# Altium schematic sheet P05 CPLD.SchDoc
size 297 x 209 mm
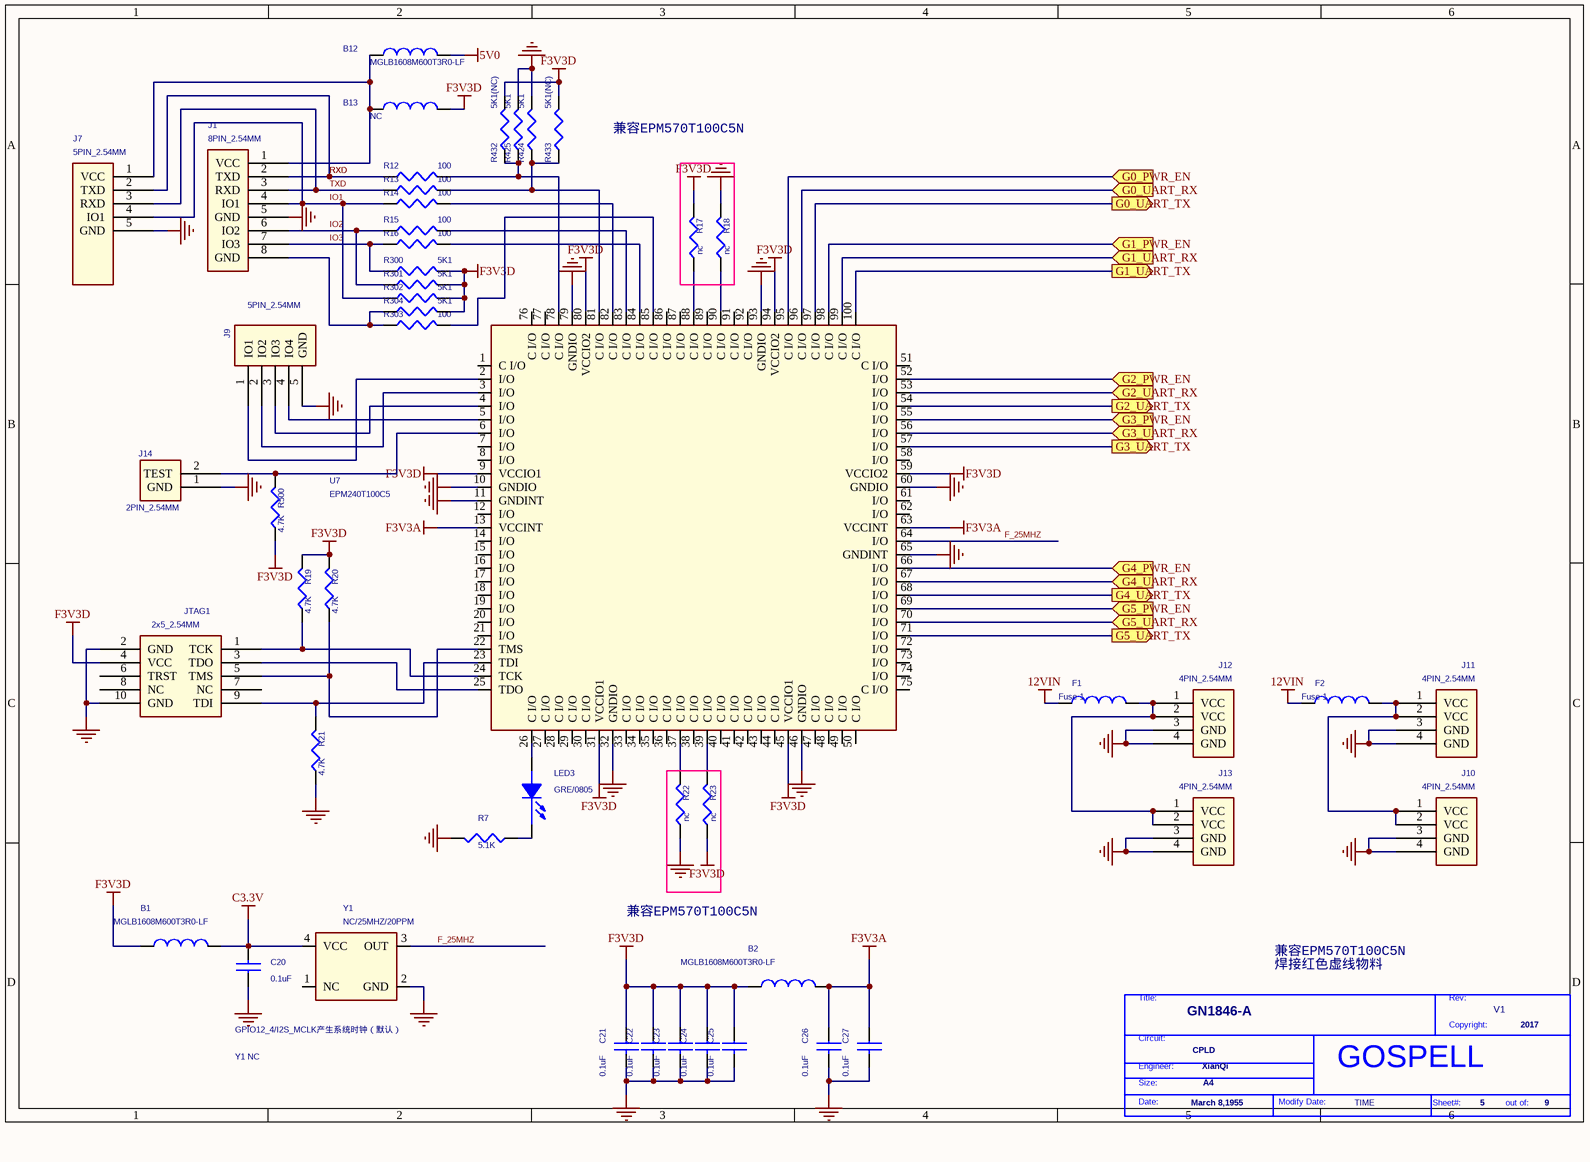
[diagram p0: P05 CPLD.SchDoc]

## Parts
*  Doc: CPLD  Page Count: 9  Page Number: 5  Page Create Date: March 8,1955  Page Size: A4  RevCode: V1  Title: GN1846-A  Copyright: 2017  Engineer: XianQi  Page Modify Date: TIME  (hidden comment: GOSPELL)  (graphical)
B1  MGLB1608M600T3R0-LF  [L0603]
B2  MGLB1608M600T3R0-LF  [L0603]
B12  MGLB1608M600T3R0-LF  [L0603]
B13  NC  [L0603]
C20  0.1uF  [0402C]
C21  0.1uF  [0402C]
C22  0.1uF  [0402C]
C23  0.1uF  [0402C]
C24  0.1uF  [0402C]
C25  0.1uF  [0402C]
C26  0.1uF  [0402C]
C27  0.1uF  [0402C]
F1  Fuse 1  [F15]
F2  Fuse 1  [F15]
J1  8PIN_2.54MM  [CON8_2D54MM_G]
J7  5PIN_2.54MM  [CON5_2D54MM_G]
J9  5PIN_2.54MM  [CON5_2D54MM_G]
J10  4PIN_2.54MM  [SIP4]
J11  4PIN_2.54MM  [SIP4]
J12  4PIN_2.54MM  [SIP4]
J13  4PIN_2.54MM  [SIP4]
J14  2PIN_2.54MM  [CN2]
JTAG1  2x5_2.54MM  [HERDER5X2]
LED3  GRE/0805  [LED0805]
R7  5.1K  [0402R]
R12  100  [0402R]
R13  100  [0402R]
R14  100  [0402R]
R15  100  [0402R]
R16  100  [0402R]
R17  nc  [0402R]
R18  nc  [0402R]
R19  4.7K  [0402R]
R20  4.7K  [0402R]
R21  4.7K  [0402R]
R22  nc  [0402R]
R23  nc  [0402R]
R300  5K1  [0402R]
R301  5K1  [0402R]
R302  5K1  [0402R]
R303  100  [0402R]
R304  5K1  [0402R]
R424  5K1  [0402R]
R425  5K1  [0402R]
R432  5K1(NC)  [0402R]
R433  5K1(NC)  [0402R]
R500  4.7K  [0402R]
U7  EPM240T100C5  [TQFP-100P]
Y1  NC/25MHZ/20PPM  [SCXO_7.0X5.0]

## Ports
G0_PWR_EN (in), G0_UART_RX (in), G0_UART_TX (out), G1_PWR_EN (in), G1_UART_RX (in), G1_UART_TX (out), G2_PWR_EN (in), G2_UART_RX (in), G2_UART_TX (out), G3_PWR_EN (in), G3_UART_RX (in), G3_UART_TX (out), G4_PWR_EN (in), G4_UART_RX (in), G4_UART_TX (out), G5_PWR_EN (in), G5_UART_RX (in), G5_UART_TX (out)

## Nets
5V0: B12.2
12VIN: F1.1 F2.1
C3.3V: B1.2 C20.2 Y1.4(VCC)
F3V3A: B2.2 C26.1 C27.1 U7.13(VCCINT) U7.63(VCCINT)
F3V3D: B1.1 B2.1 B13.2 C21.1 C22.1 C23.1 C24.1 C25.1 JTAG1.4(VCC) R17.1 R19.1 R20.1 R23.2 R300.1 R301.1 R302.1 R304.1 R432.1 R433.1 R500.2 U7.9(VCCIO1) U7.31(VCCIO1) U7.45(VCCIO1) U7.59(VCCIO2) U7.80(VCCIO2) U7.94(VCCIO2)
GND: C20.1 C21.2 C22.2 C23.2 C24.2 C25.2 C26.2 C27.2 J1.5(GND) J7.5(GND) J9.5(GND) J10.3(GND) J10.4(GND) J11.3(GND) J11.4(GND) J12.3(GND) J12.4(GND) J13.3(GND) J13.4(GND) J14.1(GND) JTAG1.2(GND) JTAG1.10(GND) R7.1 R18.1 R21.2 R22.2 R424.1 R425.1 U7.10(GNDIO) U7.11(GNDINT) U7.32(GNDIO) U7.46(GNDIO) U7.60(GNDIO) U7.65(GNDINT) U7.79(GNDIO) U7.93(GNDIO) Y1.2(GND)
F_25MHZ: U7.64(I/O) Y1.3(OUT)
G0_PWR_EN: U7.95(C_I/O) ; port G0_PWR_EN
G0_UART_RX: U7.96(C_I/O) ; port G0_UART_RX
G0_UART_TX: U7.97(C_I/O) ; port G0_UART_TX
G1_PWR_EN: U7.98(C_I/O) ; port G1_PWR_EN
G1_UART_RX: U7.99(C_I/O) ; port G1_UART_RX
G1_UART_TX: U7.100(C_I/O) ; port G1_UART_TX
G2_PWR_EN: U7.52(I/O) ; port G2_PWR_EN
G2_UART_RX: U7.53(I/O) ; port G2_UART_RX
G2_UART_TX: U7.54(I/O) ; port G2_UART_TX
G3_PWR_EN: U7.55(I/O) ; port G3_PWR_EN
G3_UART_RX: U7.56(I/O) ; port G3_UART_RX
G3_UART_TX: U7.57(I/O) ; port G3_UART_TX
G4_PWR_EN: U7.66(I/O) ; port G4_PWR_EN
G4_UART_RX: U7.67(I/O) ; port G4_UART_RX
G4_UART_TX: U7.68(I/O) ; port G4_UART_TX
G5_PWR_EN: U7.69(I/O) ; port G5_PWR_EN
G5_UART_RX: U7.70(I/O) ; port G5_UART_RX
G5_UART_TX: U7.71(I/O) ; port G5_UART_TX
IO1: J1.4(IO1) J7.4(IO1) R14.2 R302.2
IO2: J1.6(IO2) R15.2 R301.2
IO3: J1.7(IO3) R16.2 R300.2
RXD: J1.2(TXD) J7.2(TXD) R12.2
TXD: J1.3(RXD) J7.3(RXD) R13.2
NetB12_1: B12.1 B13.1 J1.1(VCC) J7.1(VCC)
NetF1_2: F1.2 J12.1(VCC) J12.2(VCC) J13.1(VCC) J13.2(VCC)
NetF2_2: F2.2 J10.1(VCC) J10.2(VCC) J11.1(VCC) J11.2(VCC)
NetJ1_8: J1.8(GND) R303.2 R304.2
NetJ9_1: J9.1(IO1) U7.2(I/O)
NetJ9_2: J9.2(IO2) U7.3(I/O)
NetJ9_3: J9.3(IO3) U7.4(I/O)
NetJ9_4: J9.4(IO4) U7.5(I/O)
NetJ14_2: J14.2(TEST) R500.1 U7.6(I/O)
NetJTAG1_1: JTAG1.1(TCK) R19.2 U7.24(TCK)
NetJTAG1_3: JTAG1.3(TDO) U7.25(TDO)
NetJTAG1_5: JTAG1.5(TMS) R20.2 U7.22(TMS)
NetJTAG1_9: JTAG1.9(TDI) R21.1 U7.23(TDI)
NetLED3_A: LED3.A(ANODE) U7.26(C_I/O)
NetLED3_K: LED3.K(CATHODE) R7.2
NetR12_1: R12.1 R425.2 R432.2 U7.78(C_I/O)
NetR13_1: R13.1 R424.2 R433.2 U7.81(C_I/O)
NetR14_1: R14.1 U7.82(C_I/O)
NetR15_1: R15.1 U7.83(C_I/O)
NetR16_1: R16.1 U7.84(C_I/O)
NetR17_2: R17.2 U7.88(C_I/O)
NetR18_2: R18.2 U7.90(C_I/O)
NetR22_1: R22.1 U7.37(C_I/O)
NetR23_1: R23.1 U7.39(C_I/O)
NetR303_1: R303.1 U7.85(C_I/O)

Not connected (* = marked no-connect by the designer): JTAG1 6(TRST) 7(NC) 8(NC); U7 1(C_I/O) 7(I/O) 8(I/O) 12(I/O) 14(I/O) 15(I/O) 16(I/O) 17(I/O) 18(I/O) 19(I/O) 20(I/O) 21(I/O) 27(C_I/O) 28(C_I/O) 29(C_I/O) 30(C_I/O) 33(C_I/O) 34(C_I/O) 35(C_I/O) 36(C_I/O) 38(C_I/O) 40(C_I/O) 41(C_I/O) 42(C_I/O) 43(C_I/O) 44(C_I/O) 47(C_I/O) 48(C_I/O) 49(C_I/O) 50(C_I/O) 51(C_I/O) 58(I/O) 61(I/O) 62(I/O) 72(I/O) 73(I/O) 74(I/O) 75(C_I/O) 76(C_I/O) 77(C_I/O) 86(C_I/O) 87(C_I/O) 89(C_I/O) 91(C_I/O) 92(C_I/O); Y1 1(NC)

## Notes on the sheet
- 兼容EPM570T100C5N
- 焊接红色虚线物料
- GPIO12_4/I2S_MCLK产生系统时钟（默认）
- Y1 NC
- (in symbol GOSPELL) Title:; Rev:; Copyright:; Circuit:; Engineer:; Size:; Date:; Modify Date:; Sheet#:; out of:

## Library data of the parts
B1 B2 B12 B13 F1 F2 = CHOKE TORROID_0
C20 = CAP NP
C21-C27 = CAP NP_Dup1
J1 = CON8_0
J7 J9-J14 = CON8_1
JTAG1 = CON10A_0
LED3 = LED_0
R7 R12-R23 R300-R304 R424 R425 R432 R433 R500 = R_Dup1
Y1 = SCXO
* = GOSPELL: Cage Code: 2017; Schematic Page Count: 9; Schematic Page Number: 5